# Altium schematic sheet Connector.SchDoc: QUTMS Shutdown V2 - Connector
size A4; Organization: QUT Motorsport; Address1: O-120; Address2: O Block; Address3: QUT Gardens Point; Address4: Brisbane, 4000; DocumentNumber: 3; SheetNumber: 3; SheetTotal: 10
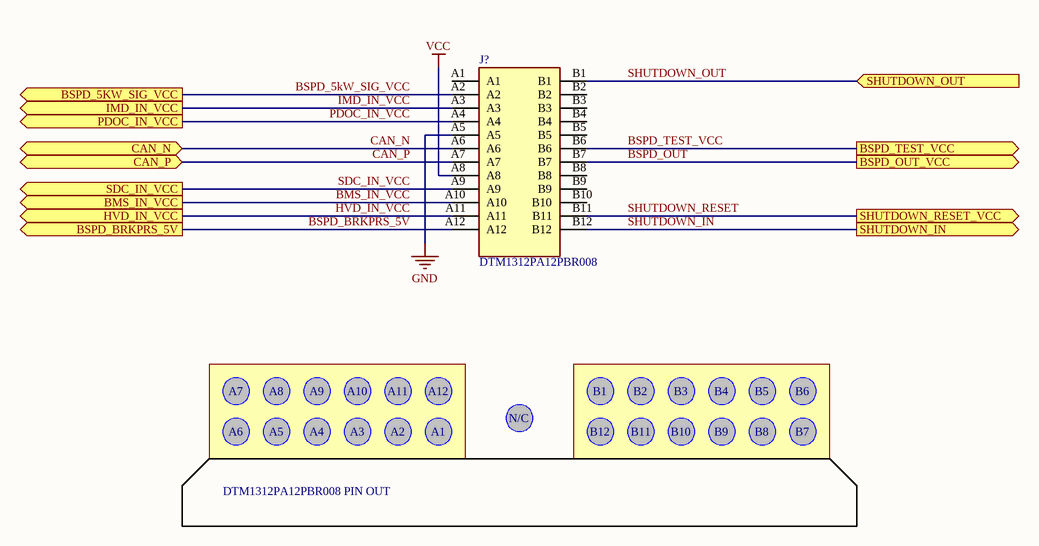
[diagram p0: Connector.SchDoc]

## Parts
J?  DTM1312PA12PBR008  [TE_DTM1312PA12PBR008]

## Ports
BMS_IN_VCC (out), BSPD_5KW_SIG_VCC (out), BSPD_BRKPRS_5V (out), BSPD_OUT_VCC (out), BSPD_TEST_VCC (out), CAN_N (bidir), CAN_P (bidir), HVD_IN_VCC (out), IMD_IN_VCC (out), PDOC_IN_VCC (out), SDC_IN_VCC (out), SHUTDOWN_IN (out), SHUTDOWN_OUT (in), SHUTDOWN_RESET_VCC (out)

## Nets
GND: J?.A5
VCC: J?.A8
BMS_IN_VCC: J?.A10 ; port BMS_IN_VCC
BSPD_5kW_SIG_VCC: J?.A2 ; port BSPD_5KW_SIG_VCC
BSPD_BRKPRS_5V: J?.A12 ; port BSPD_BRKPRS_5V
BSPD_OUT: J?.B7 ; port BSPD_OUT_VCC
BSPD_TEST_VCC: J?.B6 ; port BSPD_TEST_VCC
CAN_N: J?.A6 ; port CAN_N
CAN_P: J?.A7 ; port CAN_P
HVD_IN_VCC: J?.A11 ; port HVD_IN_VCC
IMD_IN_VCC: J?.A3 ; port IMD_IN_VCC
PDOC_IN_VCC: J?.A4 ; port PDOC_IN_VCC
SDC_IN_VCC: J?.A9 ; port SDC_IN_VCC
SHUTDOWN_IN: J?.B12 ; port SHUTDOWN_IN
SHUTDOWN_OUT: J?.B1 ; port SHUTDOWN_OUT
SHUTDOWN_RESET: J?.B11 ; port SHUTDOWN_RESET_VCC

Not connected (* = marked no-connect by the designer): J? A1 B2 B3 B4 B5 B8 B9 B10

## Notes on the sheet
- A7
- A8
- A9
- A10
- A11
- A12
- N/C
- B1
- B2
- B3
- B4
- B5
- B6
- A6
- A5
- A4
- A3
- A2
- A1
- B12
- B11
- B10
- B9
- B8
- B7
- DTM1312PA12PBR008 PIN OUT
- Title
- Size:
- Date:
- Number:
- Time:
- Revision:
- Sheet
- of
- File:

## Library data of the parts
J? = DTM1312PA12PBR008: 24 way sealed A and B key PCB header with .165 inch/4.2 millimeter centerline pitch.; MP: DTM13-12PA-12PB-R008; MF: TE Connectivity; Digi-Key_Part_Number: 1734-1131-ND; Digi-Key_Purchase_URL: https://www.digikey.com/product-detail/en/te-connectivity-deutsch-connectors/DTM13-12PA-12PB-R008/1734-1131-ND/6566695?utm_source=snapeda&utm_medium=aggregator&utm_campaign=symbol; Package: None; Value: *; TE_purchase_URL: https://www.te.com/usa-en/product-DTM1312PA12PBR008.html?te_bu=Cor&te_type=disp&te_campaign=seda_glo_cor-seda-global-disp-prtnr-fy19-seda-model-bom-cta_sma-317_1&elqCampaignId=32493; SnapEDA_Link: https://www.snapeda.com/parts/DTM13-12PA-12PB-R008/TE%20Connectivity%20Deutsch%20Connectors/view-part/490507/?ref=snap